# EAGLE design irdajoy-v2 (EAGLE 5.00)
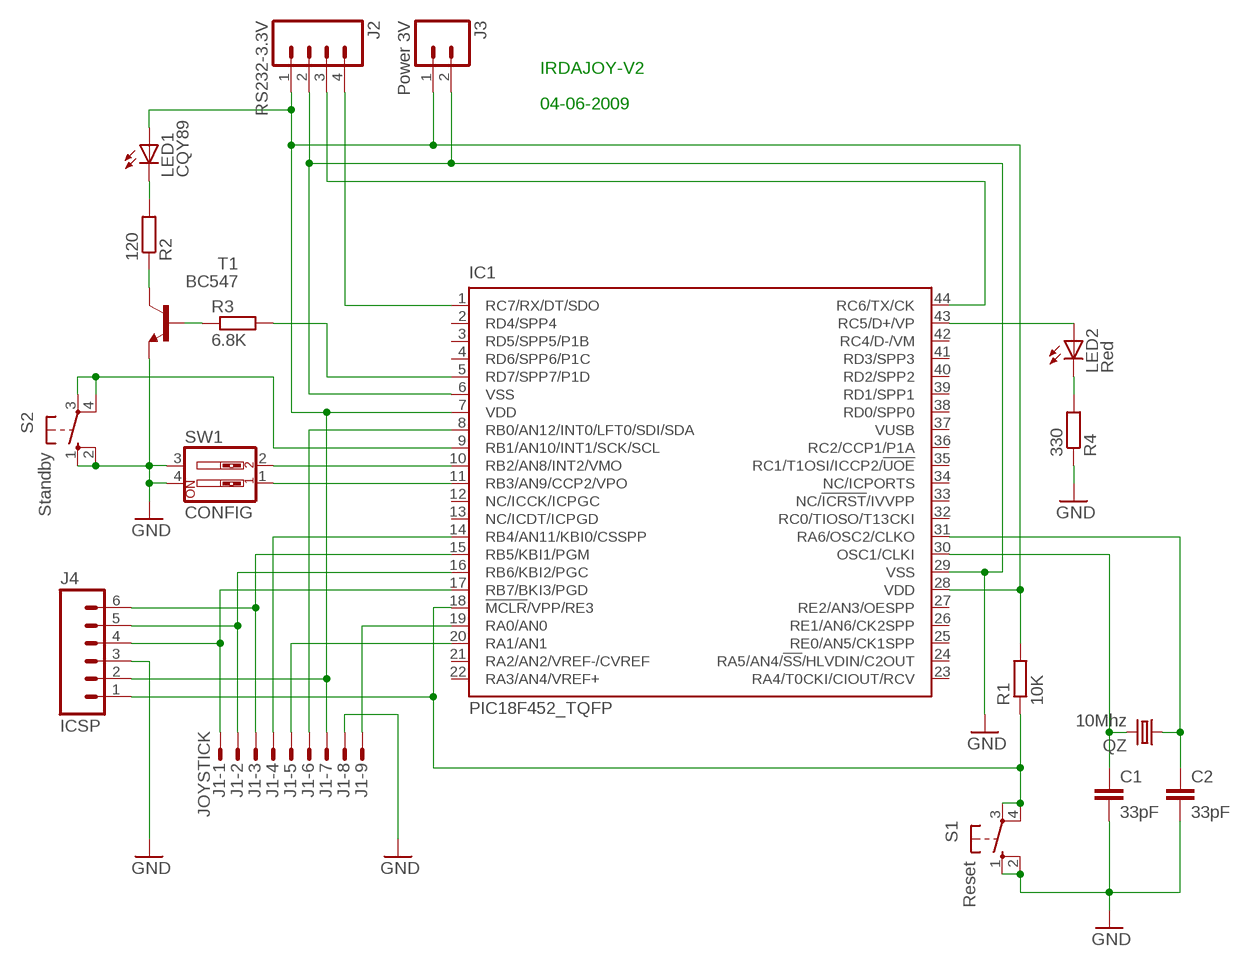
[diagram p0: schematic, sheet 1]

## Parts
C1  33pF  C-EU025-024X044  [C025-024X044]
C2  33pF  C-EU025-024X044  [C025-024X044]
IC1  PIC18F452_TQFP  PIC18F4550_TQFP  [TQFP44]
J1  JOYSTICK  M09HS  [M09H]
J2  RS232-3.3V  M04PTH  [1X04]
J3  Power 3V  M02PTH  [1X02]
J4  ICSP  M06SIP  [1X06]
LED1  CQY89  LED5MM  [LED5MM]
LED2  Red  LED5MM  [LED5MM]
QZ  10Mhz  CRYSTALHC49S  [HC49/S]
R1  10K  R-EU_0204/2V  [0204V]
R2  120  R-EU_0204/2V  [0204V]
R3  6.8K  R-EU_0204/2V  [0204V]
R4  330  R-EU_0204/2V  [0204V]
S1  Reset  10-XX  [B3F-10XX]
S2  Standby  10-XX  [B3F-10XX]
SW1  CONFIG  SW_DIP-2  [DIPSWITCH-02]
T1  BC547  [TO92]

## Nets
GND: C1.2 C2.2 IC1.6(VSS) IC1.29(VSS) J1.8 J2.2 J3.2 J4.3 R4.1 S1.1(S) S1.2(S1) S2.1(S) S2.2(S1) SW1.3 SW1.4 T1.1(E)
N$1: LED1.K(C) R2.2
N$2: IC1.7(VDD) IC1.28(VDD) J1.7 J2.1 J3.1 J4.2 LED1.A R1.2
N$3: IC1.5(RD7/SPP7/P1D) R3.2
N$4: R3.1 T1.2(B)
N$5: IC1.44(RC6/TX/CK) J2.3
N$6: IC1.1(RC7/RX/DT/SDO) J2.4
N$7: IC1.18(!MCLR!/VPP/RE3) J4.1 R1.1 S1.3(P) S1.4(P1)
N$8: R2.1 T1.3(C)
N$9: IC1.10(RB2/AN8/INT2/VMO) SW1.2
N$10: IC1.11(RB3/AN9/CCP2/VPO) SW1.1
N$11: IC1.17(RB7/BKI3/PGD) J1.1 J4.4
N$12: IC1.16(RB6/KBI2/PGC) J1.2 J4.5
N$13: IC1.15(RB5/KBI1/PGM) J1.3 J4.6
N$14: IC1.14(RB4/AN11/KBI0/CSSPP) J1.4
N$15: IC1.20(RA1/AN1) J1.5
N$16: IC1.19(RA0/AN0) J1.9
N$17: IC1.8(RB0/AN12/INT0/LFT0/SDI/SDA) J1.6
N$18: IC1.43(RC5/D+/VP) LED2.A
N$19: IC1.9(RB1/AN10/INT1/SCK/SCL) S2.3(P) S2.4(P1)
N$20: LED2.K(C) R4.2
N$37: C1.1 IC1.30(OSC1/CLKI) QZ.2
N$38: C2.1 IC1.31(RA6/OSC2/CLKO) QZ.1
Unconnected: IC1.2(RD4/SPP4) IC1.3(RD5/SPP5/P1B) IC1.4(RD6/SPP6/P1C) IC1.12(NC/ICCK/ICPGC) IC1.13(NC/ICDT/ICPGD) IC1.21(RA2/AN2/VREF-/CVREF) IC1.22(RA3/AN4/VREF+) IC1.23(RA4/T0CKI/CIOUT/RCV) IC1.24(RA5/AN4/!SS!/HLVDIN/C2OUT) IC1.25(RE0/AN5/CK1SPP) IC1.26(RE1/AN6/CK2SPP) IC1.27(RE2/AN3/OESPP) IC1.32(RC0/TIOSO/T13CKI) IC1.33(NC/!ICRST!/IVVPP) IC1.34(NC/ICPORTS) IC1.35(RC1/T1OSI/ICCP2/!UOE) IC1.36(RC2/CCP1/P1A) IC1.37(VUSB) IC1.38(RD0/SPP0) IC1.39(RD1/SPP1) IC1.40(RD2/SPP2) IC1.41(RD3/SPP3) IC1.42(RC4/D-/VM)

## Notes on the sheet
- IRDAJOY-V2
- 04-06-2009

## Library data of the parts
C1 C2 = resistor:C-EU: CAPACITOR, European symbol
IC1 = microchip:PIC18F4*_TQFP: USB Microcontrollers with nanoWatt Technology High-Performance, Enhanced Flash, 28/40/44-Pin, Source: http://ww1.microchip.com/downloads/en/devicedoc/39632c.pdf
J1 = con-subd:M09?S: SUB-D
J2 = SparkFun:M04: Header 4 Standard 4-pin 0.1" header. Use with straight break away headers (SKU : PRT-00116), right angle break away headers (PRT-00553), swiss pins (PRT-00743), machine pins (PRT-00117), and female headers (PRT-00115). Molex polarized connector foot print use with SKU : PRT-08231 with associated crimp pins and housings.
J3 = SparkFun:M02: Header 2 Standard 2-pin 0.1" header. Use with straight break away headers (SKU : PRT-00116), right angle break away headers (PRT-00553), swiss pins (PRT-00743), machine pins (PRT-00117), and female headers (PRT-00115). Molex polarized connector foot print use with SKU : PRT-08233 with associated crimp pins and housings.
J4 = SparkFun:M06: Header 6 Standard 6-pin 0.1" header. Use with straight break away headers (SKU : PRT-00116), right angle break away headers (PRT-00553), swiss pins (PRT-00743), machine pins (PRT-00117), and female headers (PRT-00115). Molex polarized connector foot print use with SKU : PRT-08094 with associated crimp pins and housings.
LED1 LED2 = led:LED: LED OSRAM: - CHIPLED LG R971, LG N971, LY N971, LG Q971, LY Q971, LO R971, LY R971 LH N974, LH R974 LS Q976, LO Q976, LY Q976 LO Q996 - Hyper CHIPLED LW Q18S LB Q993, LB Q99A, LB R99A - SideLED LS A670, LO A670, LY A670, LG A670, LP A670 LB A673, LV A673, LT A673, LW A673 LH A674 LY A675 LS A676, LA A676, LO A676, LY A676, LW A676 LS A679, LY A679, LG A679 - Hyper Micro SIDELED® LS Y876, LA Y876, LO Y876, LY Y876 LT Y87S - SmartLED LW L88C, LW L88S LB L89C, LB L89S, LG L890 LS L89K, LO L89K, LY L89K LS L896, LA L896, LO L896, LY L896 - TOPLED LS T670, LO T670, LY T670, LG T670, LP T670 LSG T670, LSP T670, LSY T670, LOP T670, LYG T670 LG T671, LOG T671, LSG T671 LB T673, LV T673, LT T673, LW T673 LH T674 LS T676, LA T676, LO T676, LY T676, LB T676, LH T676, LSB T676, LW T676 LB T67C, LV T67C, LT T67C, LS T67K, LO T67K, LY T67K, LW E67C LS E67B, LA E67B, LO E67B, LY E67B, LB E67C, LV E67C, LT E67C LW T67C LS T679, LY T679, LG T679 LS T770, LO T770, LY T770, LG T770, LP T770 LB T773, LV T773, LT T773, LW T773 LH T774 LS E675, LA E675, LY E675, LS T675 LS T776, LA T776, LO T776, LY T776, LB T776 LHGB T686 LT T68C, LB T68C - Hyper Mini TOPLED® LB M676 - Mini TOPLED Santana® LG M470 LS M47K, LO M47K, LY M47K Source: http://www.osram.convergy.de - LUMILED® LXK2-PW12-R00, LXK2-PW12-S00, LXK2-PW14-U00, LXK2-PW14-V00 LXK2-PM12-R00, LXK2-PM12-S00, LXK2-PM14-U00 LXK2-PE12-Q00, LXK2-PE12-R00, LXK2-PE12-S00, LXK2-PE14-T00, LXK2-PE14-U00 LXK2-PB12-K00, LXK2-PB12-L00, LXK2-PB12-M00, LXK2-PB14-N00, LXK2-PB14-P00, LXK2-PB14-Q00 LXK2-PR12-L00, LXK2-PR12-M00, LXK2-PR14-Q00, LXK2-PR14-R00 LXK2-PD12-Q00, LXK2-PD12-R00, LXK2-PD12-S00 LXK2-PH12-R00, LXK2-PH12-S00 LXK2-PL12-P00, LXK2-PL12-Q00, LXK2-PL12-R00 Source: www.luxeon.com
QZ = crystal:CRYSTAL: CRYSTAL
R1 = resistor:R-EU_: RESISTOR, European symbol
R2-R4 = rcl:R-EU_: RESISTOR, European symbol
S1 S2 = switch-omron:10-XX: OMRON SWITCH
SW1 = SparkFun:SW_DIP-2: DIP SWITCH
T1 = transistor-neu-to92:BC547: NPN TRANSISTOR

## Board
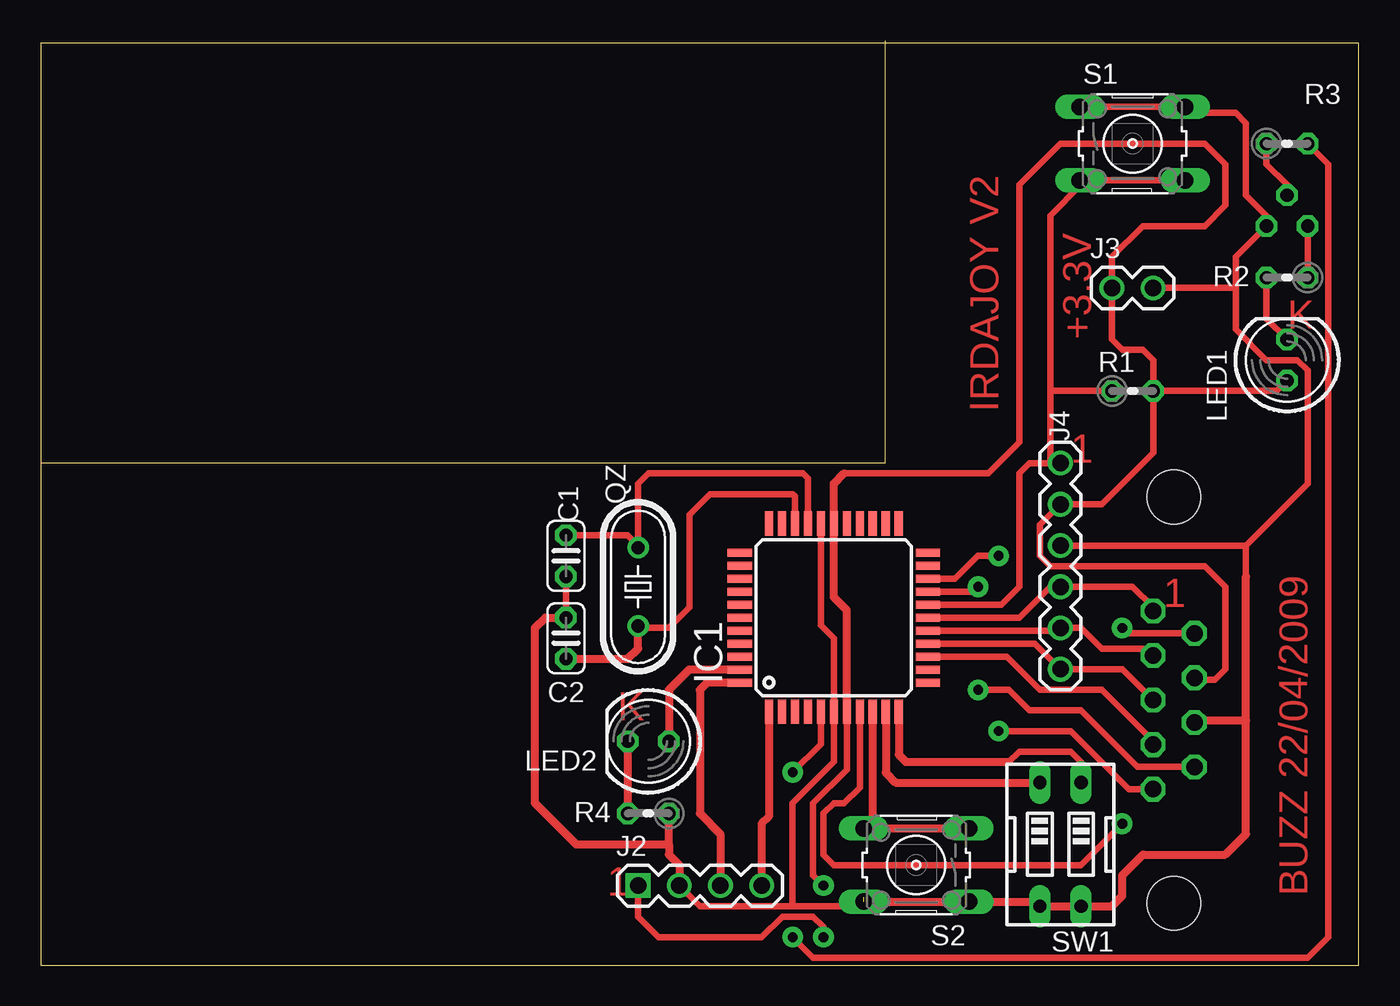
[diagram p1: board, top side]
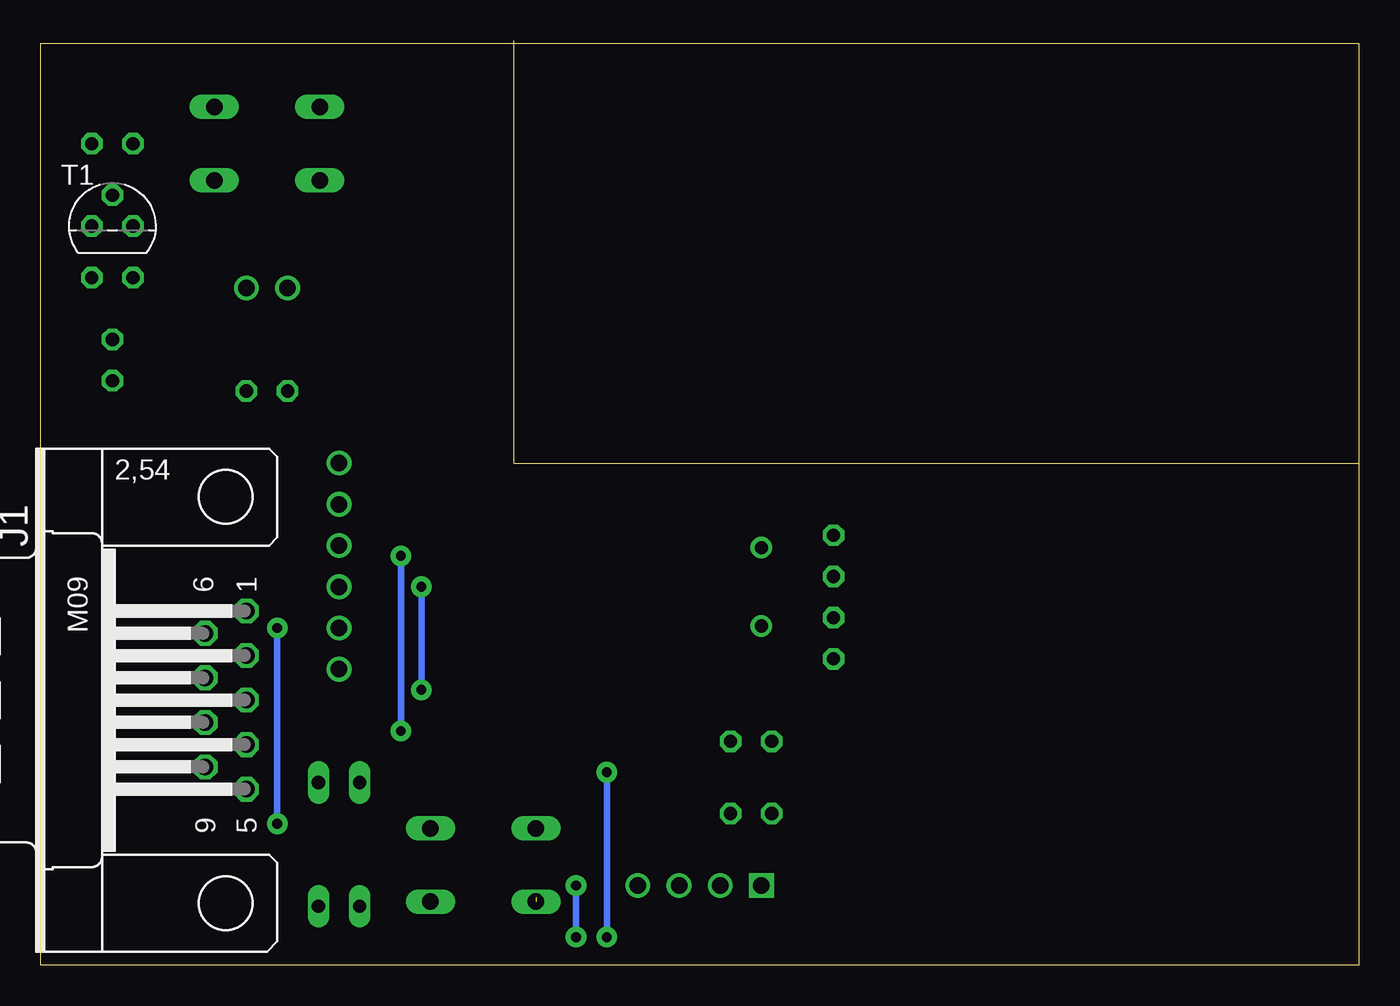
[diagram p2: board, bottom side, seen from below]

Size 81.27 x 56.98 mm. Coordinates in mm from the lower left corner, seen from the top.
Outline: 52.07,56.98 52.07,30.95 0,30.95
Outline: 0.01,0 81.27,0 81.27,56.82 0.01,56.82 0.01,0
Copper layers (1*16): Top 0.035mm / dielectric 1.5mm / Bottom 0.035mm
Design rules "default": minimum track width 10mil, minimum drill 24mil, track to track 8mil, track to pad 8mil, pad to pad 8mil, via to via 8mil, smd to smd 8mil, copper to edge 40mil, drill to drill 8mil, minimum pad ring 10mil, minimum via ring 8mil, stop-mask expansion 4mil, vias tented up to drill 0mil, thermal gap 10mil

### Footprints (pad centres in the part's own frame; a part is rotated, then mirrored left to right if it is on the bottom)
C025-024X044 = drill 0.813 octagon: 1 -1.27,0; 2 1.27,0
TQFP44 = smd 1.5 x 0.5: 1 -5.8,4; 2 -5.8,3.2; 3 -5.8,2.4; 4 -5.8,1.6; 5 -5.8,0.8; 6 -5.8,0; 7 -5.8,-0.8; 8 -5.8,-1.6; 9 -5.8,-2.4; 10 -5.8,-3.2; 11 -5.8,-4; 23 5.8,-4; 24 5.8,-3.2; 25 5.8,-2.4; 26 5.8,-1.6; 27 5.8,-0.8; 28 5.8,0; 29 5.8,0.8; 30 5.8,1.6; 31 5.8,2.4; 32 5.8,3.2; 33 5.8,4 | smd 0.5 x 1.5: 12 -4,-5.8; 13 -3.2,-5.8; 14 -2.4,-5.8; 15 -1.6,-5.8; 16 -0.8,-5.8; 17 0,-5.8; 18 0.8,-5.8; 19 1.6,-5.8; 20 2.4,-5.8; 21 3.2,-5.8; 22 4,-5.8; 34 4,5.8; 35 3.2,5.8; 36 2.4,5.8; 37 1.6,5.8; 38 0.8,5.8; 39 0,5.8; 40 -0.8,5.8; 41 -1.6,5.8; 42 -2.4,5.8; 43 -3.2,5.8; 44 -4,5.8
M09H = drill 1.016 octagon: 1 -5.486,1.27; 2 -2.743,1.27; 3 0,1.27; 4 2.743,1.27; 5 5.486,1.27; 6 -4.115,-1.27; 7 -1.372,-1.27; 8 1.372,-1.27; 9 4.115,-1.27 | hole 3.302: 12.522,0; -12.522,0
1X04 = drill 1.016 square: 1 0,0 | drill 1.016 round: 2 2.54,0; 3 5.08,0; 4 7.62,0
1X02 = drill 1.016 round: 1 0,0; 2 2.54,0
1X06 = drill 1.016 round: 1 0,0; 2 2.54,0; 3 5.08,0; 4 7.62,0; 5 10.16,0; 6 12.7,0
LED5MM = drill 0.813 octagon: A -1.27,0; K 1.27,0
HC49/S = drill 0.813 round: 1 -2.413,0; 2 2.413,0
0204V = drill 0.813 octagon: 1 -1.27,0; 2 1.27,0
B3F-10XX = drill 1.016 long: 1 -3.251,2.261; 2 3.251,2.261; 3 -3.251,-2.261; 4 3.251,-2.261
DIPSWITCH-02 = drill 0.813 long: 1 -1.27,-3.81; 2 1.27,-3.81; 3 1.27,3.81; 4 -1.27,3.81
TO92 = drill 0.813 octagon: 1 1.27,0; 2 0,1.905; 3 -1.27,0

### Placement (x,y rotation side)
C1  32.39,25.23 270 top
C2  32.39,20.16 90 top
IC1  48.89,21.43 90 top
J1  69.85,16.34 270 bottom
J2  36.83,4.92 0 top
J3  66.04,41.74 0 top
J4  62.86,30.95 270 top
LED1  76.84,37.3 90 top
LED2  37.47,13.8 180 top
QZ  36.83,23.33 90 top
R1  67.31,35.4 0 top
R2  76.84,42.38 180 top
R3  76.84,50.63 0 top
R4  37.47,9.36 180 top
S1  67.31,50.63 0 top
S2  53.98,6.18 180 top
SW1  62.86,7.45 180 top
T1  76.84,45.55 0 bottom

### Tracks (layer width: path | path; a pad name or v marks a point on that pad's centre or on a via)
GND  (1 unrouted)
  Top 0.406: IC1.29 48.09,20.96 48.89,20.16 IC1.6 48.89,12.54 46.36,10 46.36,3.65 | S1.1 70.21,52.9 70.48,53.17 | 73.66,41.74 73.66,39.2 75.56,37.3 77.47,37.3 78.11,36.66 78.11,29.68 74.3,25.87 | 73.66,41.74 J3.2 | 70.48,53.17 70.56,53.1 S1.2 | 70.48,53.17 71.12,52.54 73.66,52.54 74.3,51.91 74.3,47.46 75.56,46.19 T1.1 73.66,43.65 73.66,41.74 | 50.72,4.2 50.8,4.28 | 74.3,25.87 J4.3 | 74.3,23.96 74.3,25.87 | S2.2 50.72,3.72 50.8,3.65 46.36,3.65 | J2.2 40.64,3.65 46.36,3.65 | C2.2 C1.2
  Top 0.5: J2.2 39.37,6.18 38.73,6.82 38.73,7.45 | 38.73,7.45 R4.1 | 38.73,7.45 33.02,7.45 30.48,10 30.48,20.79 31.12,21.43 C2.2 | S2.2 56.87,3.92 57.15,3.65 57.23,3.72 S2.1 61.32,3.92 SW1.3 SW1.4 66.04,3.65 66.67,4.28 66.67,5.55 67.95,6.82 73.03,6.82 74.3,8.09 74.3,15.07 | J1.8 71.12,15.07 74.3,15.07 | 74.3,15.07 74.3,23.96
N$1
  Top 0.406: LED1.K 75.56,39.84 R2.2
N$2  (via drill 0.6 pad 1.27)
  Top 0.406: LED1.A 76.2,35.4 R1.2 | R1.2 68.58,37.3 67.95,37.94 66.67,37.94 66.04,38.57 J3.1 66.04,43.65 67.95,45.55 71.75,45.55 73.03,46.83 73.03,49.37 71.75,50.63 62.86,50.63 60.33,48.09 60.33,32.22 58.42,30.31 49.53,30.31 | R1.2 68.58,31.59 65.41,28.41 J4.2 61.59,27.14 61.59,25.23 62.23,24.6 71.75,24.6 73.03,23.33 73.03,18.25 72.39,17.62 71.12,17.62 J1.7 | IC1.7 49.7,12.07 47.62,10 47.62,5.55 v48.26,4.92 | v48.26,1.74 48.26,2.38 47.62,3.01 45.72,3.01 44.45,1.74 38.1,1.74 36.83,3.01 J2.1
  Top 0.5: IC1.7 49.7,21.89 48.89,22.7 IC1.28 48.89,29.68 49.53,30.31
  Bottom 0.406: v48.26,4.92 v48.26,1.74
N$3  (via drill 0.6 pad 1.27)
  Top 0.406: R3.2 79.38,49.37 79.38,1.74 78.11,0.47 47.62,0.47 v46.36,1.74 | IC1.5 48.09,13.64 v46.36,11.9
  Bottom 0.406: v46.36,1.74 v46.36,11.9
N$4
  Top 0.406: R3.1 75.56,49.37 76.84,48.09 T1.2
N$5
  Top 0.5: IC1.44 41.09,17.43 40.64,16.98 40.64,9.36 41.91,8.09 J2.3
N$6
  Top 0.5: IC1.1 44.9,9.17 44.45,8.73 J2.4
N$7
  Top 0.406: 62.23,35.4 R1.1 | S1.4 70.56,48.17 70.48,48.09 70.21,48.37 S1.3 64.06,48.17 64.14,48.09 62.23,46.19 62.23,35.4 | IC1.18 59.22,22.23 60.33,23.33 60.33,30.31 60.96,30.95 62.23,30.95 | 62.23,30.95 J4.1 | 62.23,30.95 62.23,35.4
N$8
  Top 0.406: T1.3 R2.1
N$9
  Top 0.5: IC1.10 52.09,11.88 52.7,11.27 SW1.2
N$10
  Top 0.406: SW1.1 64.14,12.54 63.5,13.17 60.33,13.17 59.69,12.54
  Top 0.5: IC1.11 52.89,12.98 53.34,12.54 59.69,12.54
N$11
  Top 0.406: 68.58,22.06 67.31,23.33 J4.4 62.23,23.33 60.33,21.43 IC1.17
  Top 0.5: 68.58,22.06 J1.1
N$12
  Top 0.406: IC1.16 62.7,20.62 J4.5 64.14,20.79 65.41,19.52 67.95,19.52 68.58,18.89 J1.2
N$13
  Top 0.406: IC1.15 61.29,19.82 J4.6 66.67,18.25 J1.3
N$14
  Top 0.406: IC1.14 59.55,19.03 61.59,16.98 65.41,16.98 68.58,13.8 J1.4
N$15  (via drill 0.6 pad 1.27)
  Top 0.406: IC1.20 56.38,23.82 57.78,25.23 v59.06,25.23 | J1.5 67.08,10.86 63.5,14.44 v59.06,14.44
  Bottom 0.406: v59.06,14.44 v59.06,25.23
N$16  (via drill 0.6 pad 1.27)
  Top 0.406: IC1.19 57.48,23.03 v57.78,23.33 | v57.78,16.98 59.69,16.98 60.96,15.71 64.14,15.71 67.61,12.23 J1.9
  Bottom 0.406: v57.78,16.98 v57.78,23.33
N$17  (via drill 0.6 pad 1.27)
  Top 0.406: v66.67,8.73 64.14,6.18 48.89,6.18 48.26,6.82 48.26,9.36 48.89,10 49.53,10 50.5,10.96 IC1.8 | J1.6 67,20.46 v66.67,20.79
  Bottom 0.406: v66.67,8.73 v66.67,20.79
N$18
  Top 0.5: IC1.43 39.98,18.23 38.73,16.98 LED2.A
N$19
  Top 0.5: IC1.9 51.3,8.59 50.8,8.09 50.72,8.17 S2.4 56.79,8.45 57.15,8.09 57.23,8.17 S2.3
N$20
  Top 0.5: LED2.K R4.2
N$37
  Top 0.406: IC1.30 47.3,30.01 46.99,30.31 37.47,30.31 36.83,29.68 36.83,25.87 | 36.83,25.87 QZ.2 | C1.1 36.2,26.5 36.83,25.87
N$38
  Top 0.406: IC1.31 46.5,28.91 46.36,29.05 41.28,29.05 40.01,27.77 40.01,22.06 38.73,20.79 36.83,20.79
  Top 0.5: QZ.1 36.83,20.79 36.83,19.52 36.2,18.89 C2.1

### Text on the board
Top: K | +3.3V | IRDAJOY V2 | 1 | 1 | K | 1 | BUZZ 22/04/2009